# Altium schematic sheet 0273_GPU STRAPS-2.SchDoc
size 848 x 558 mm
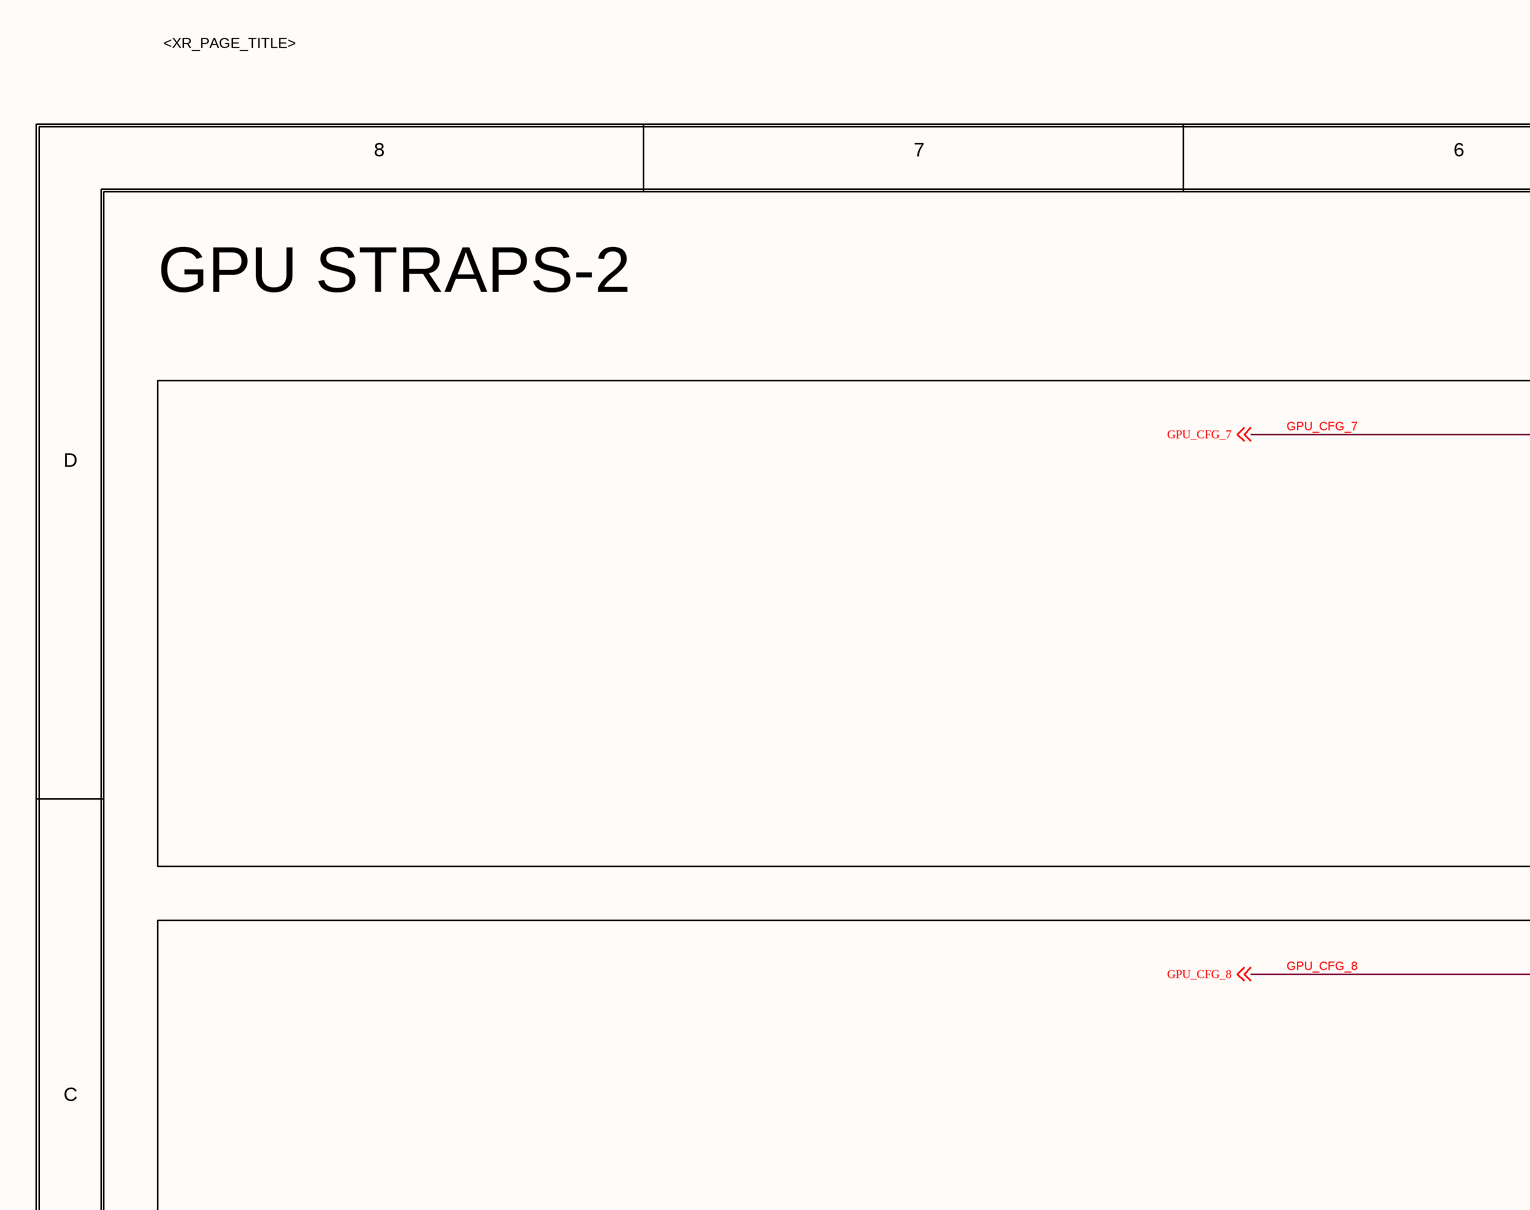
[diagram p0: 0273_GPU STRAPS-2.SchDoc, top left]
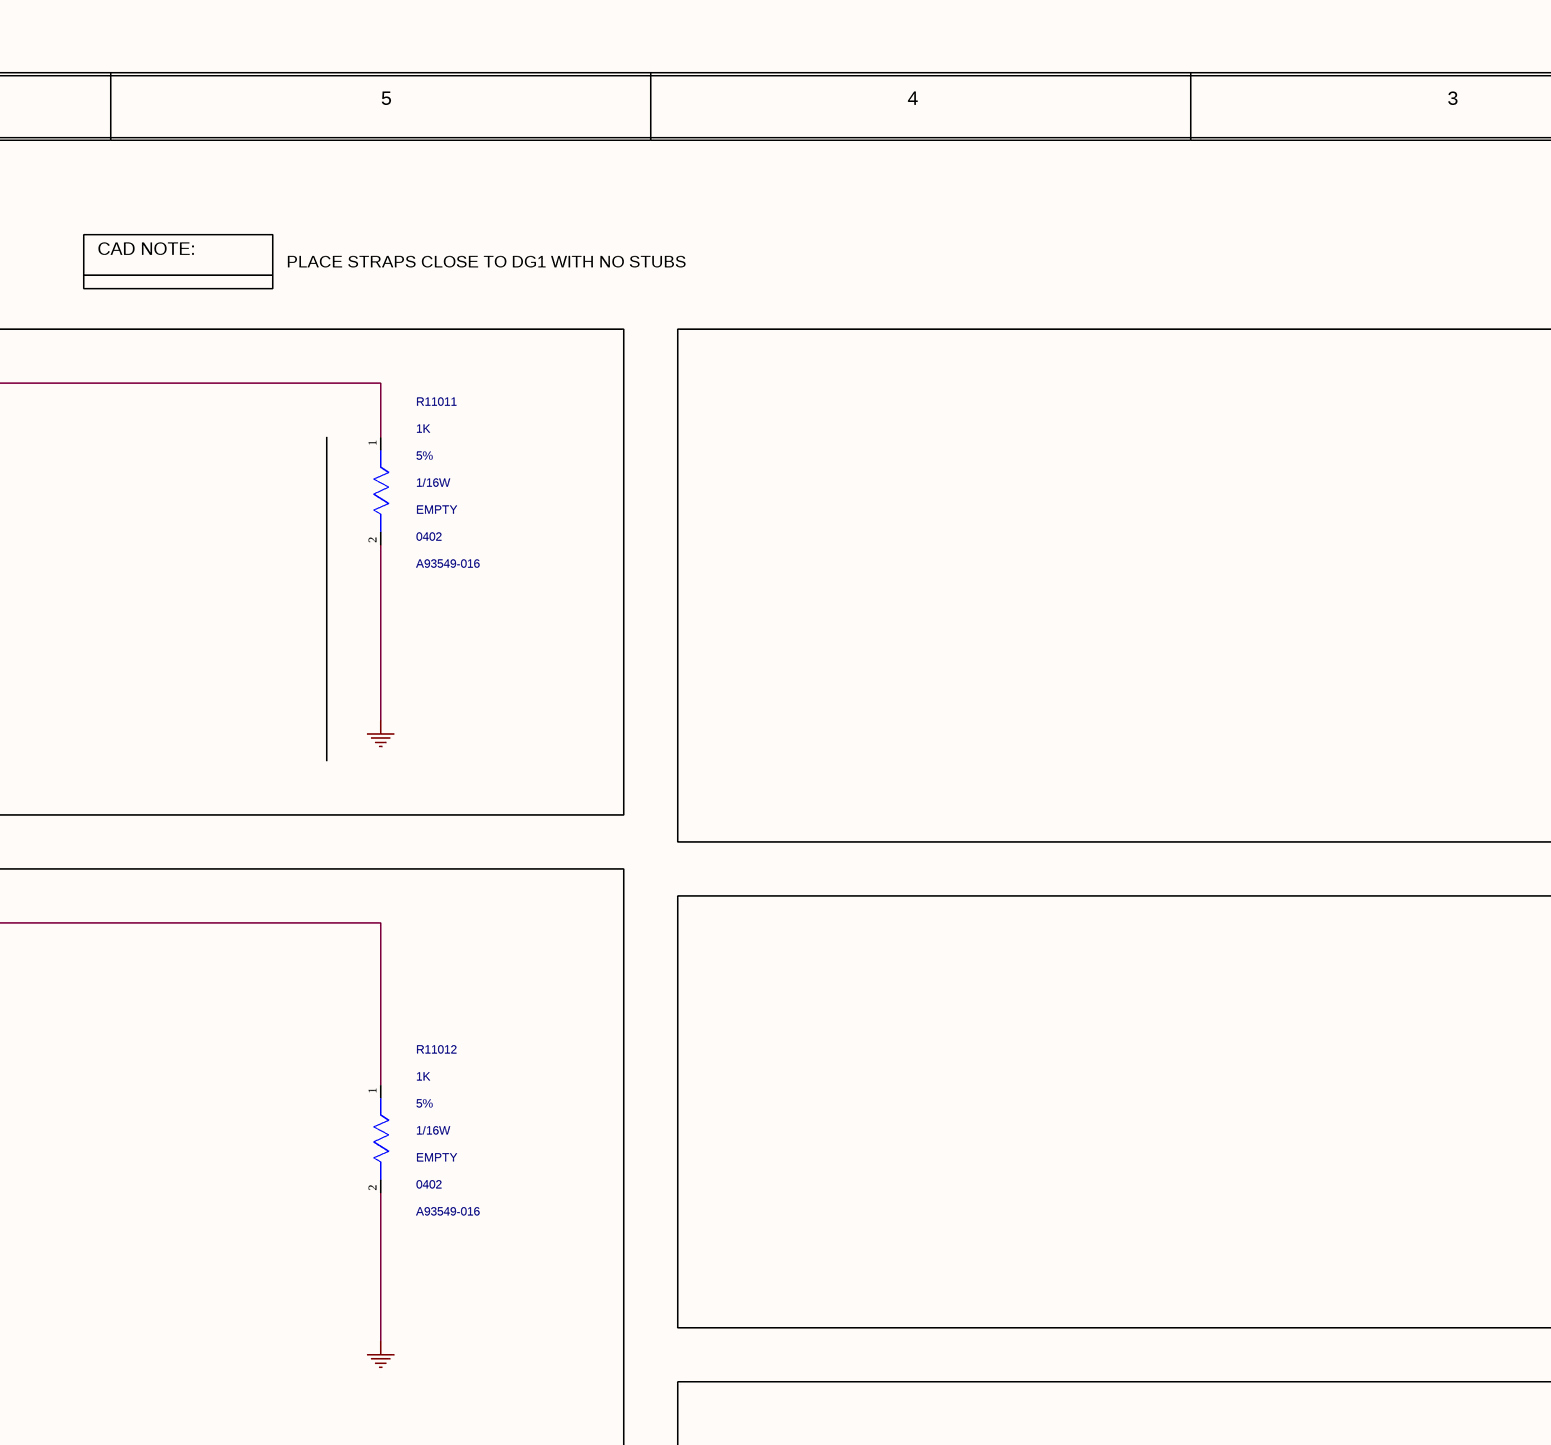
[diagram p1: 0273_GPU STRAPS-2.SchDoc, top middle]
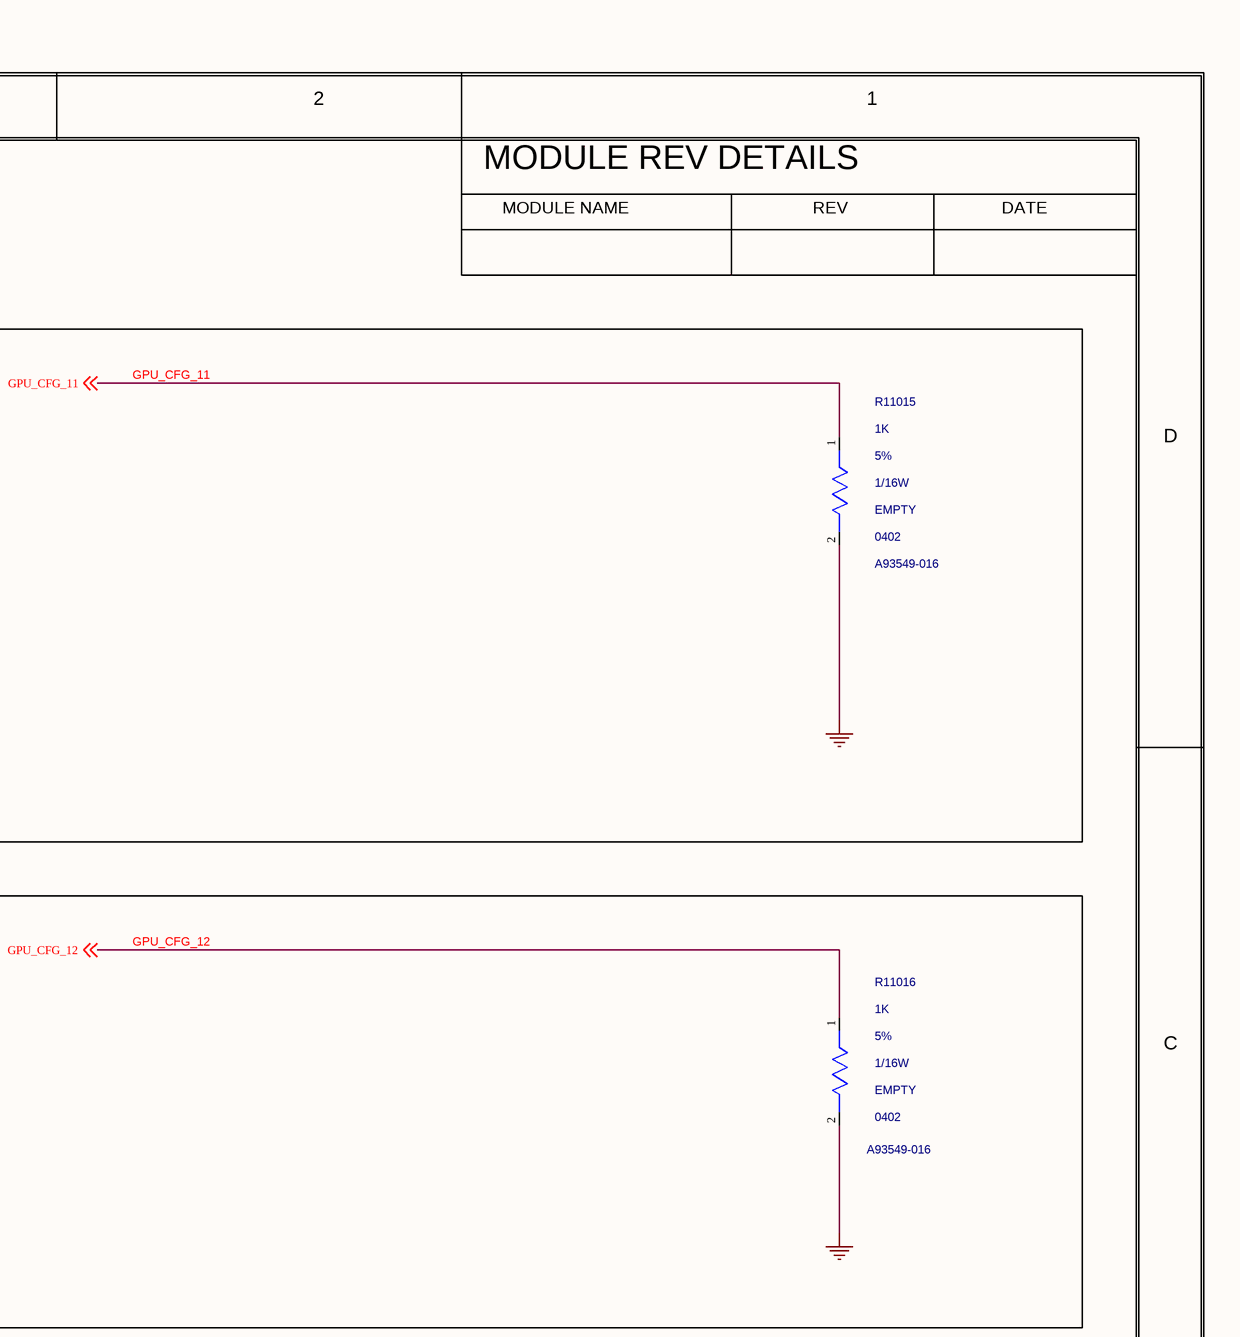
[diagram p2: 0273_GPU STRAPS-2.SchDoc, top right]
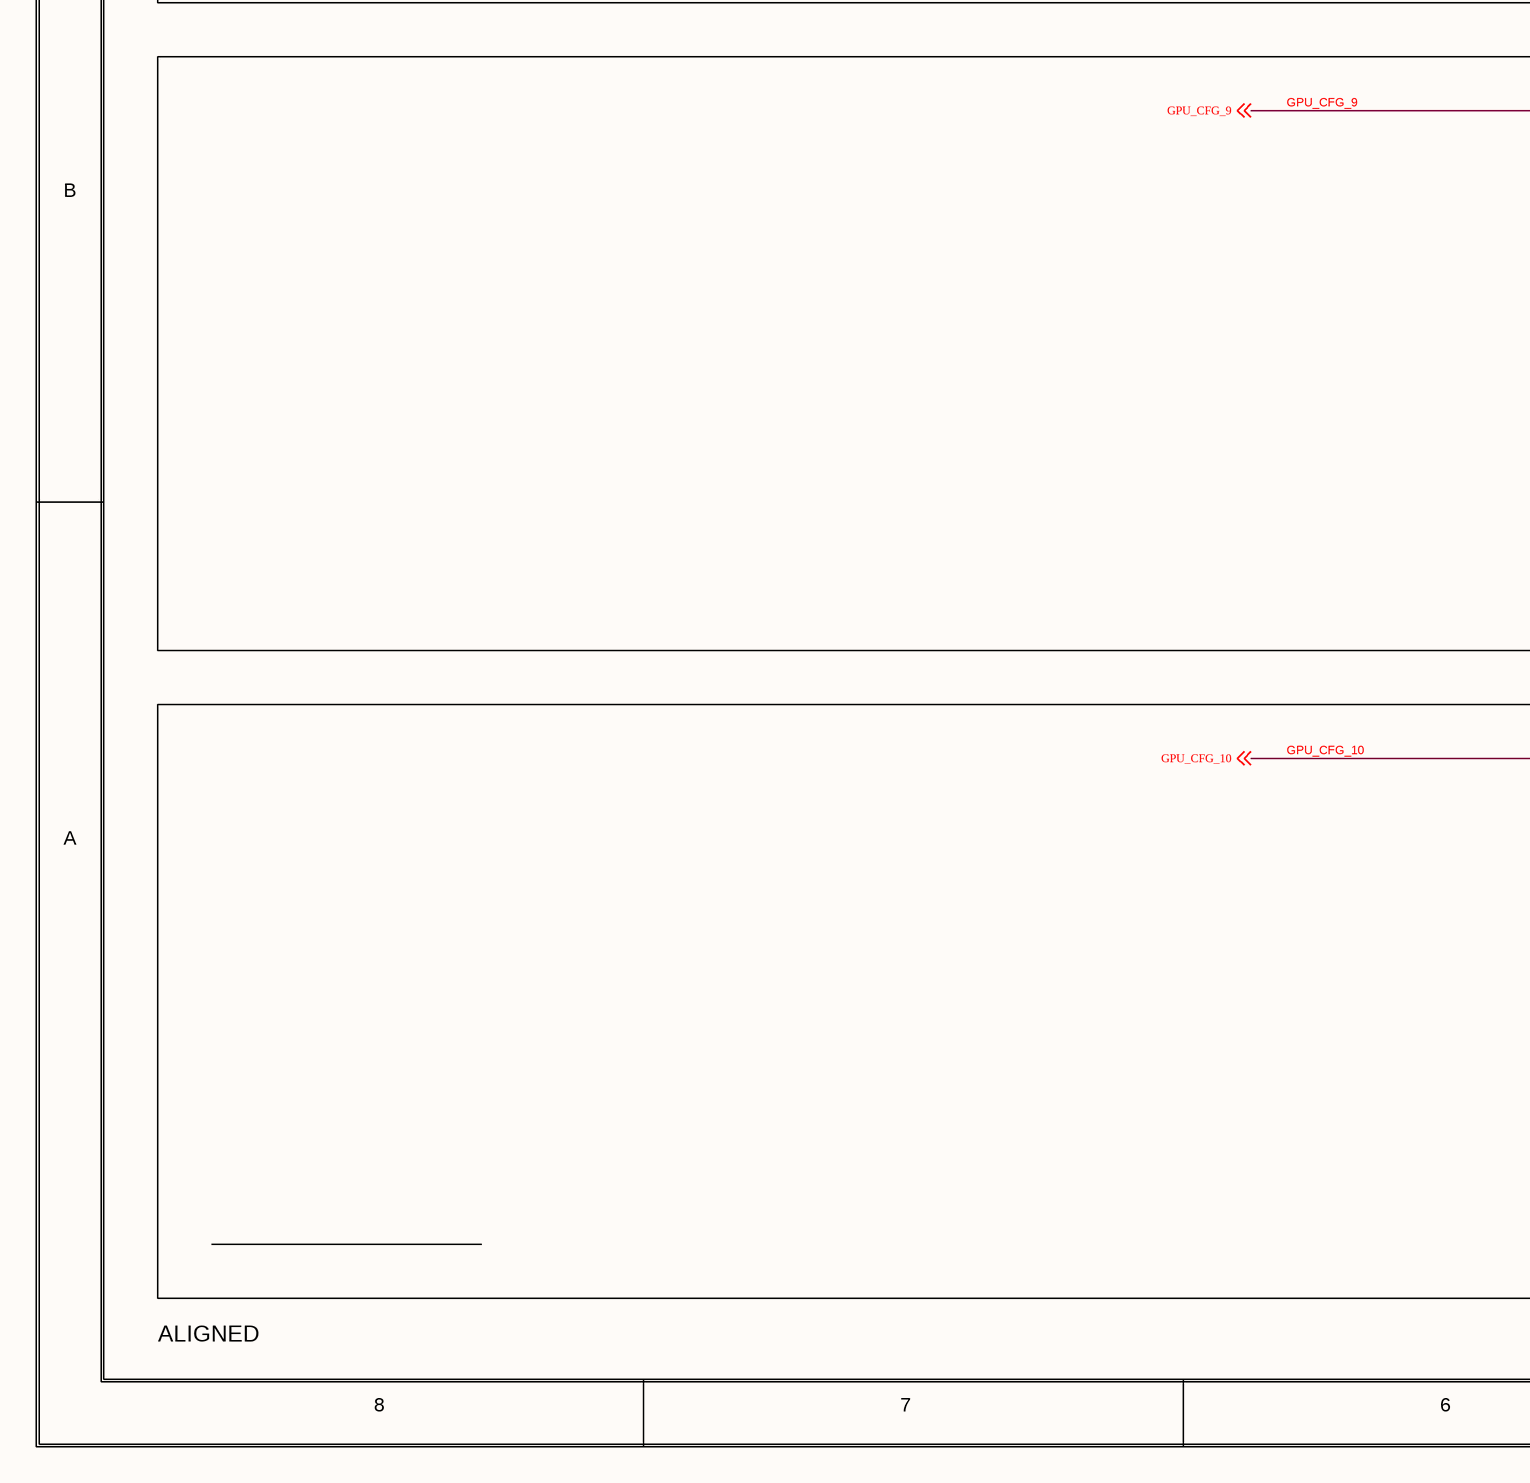
[diagram p3: 0273_GPU STRAPS-2.SchDoc, bottom left]
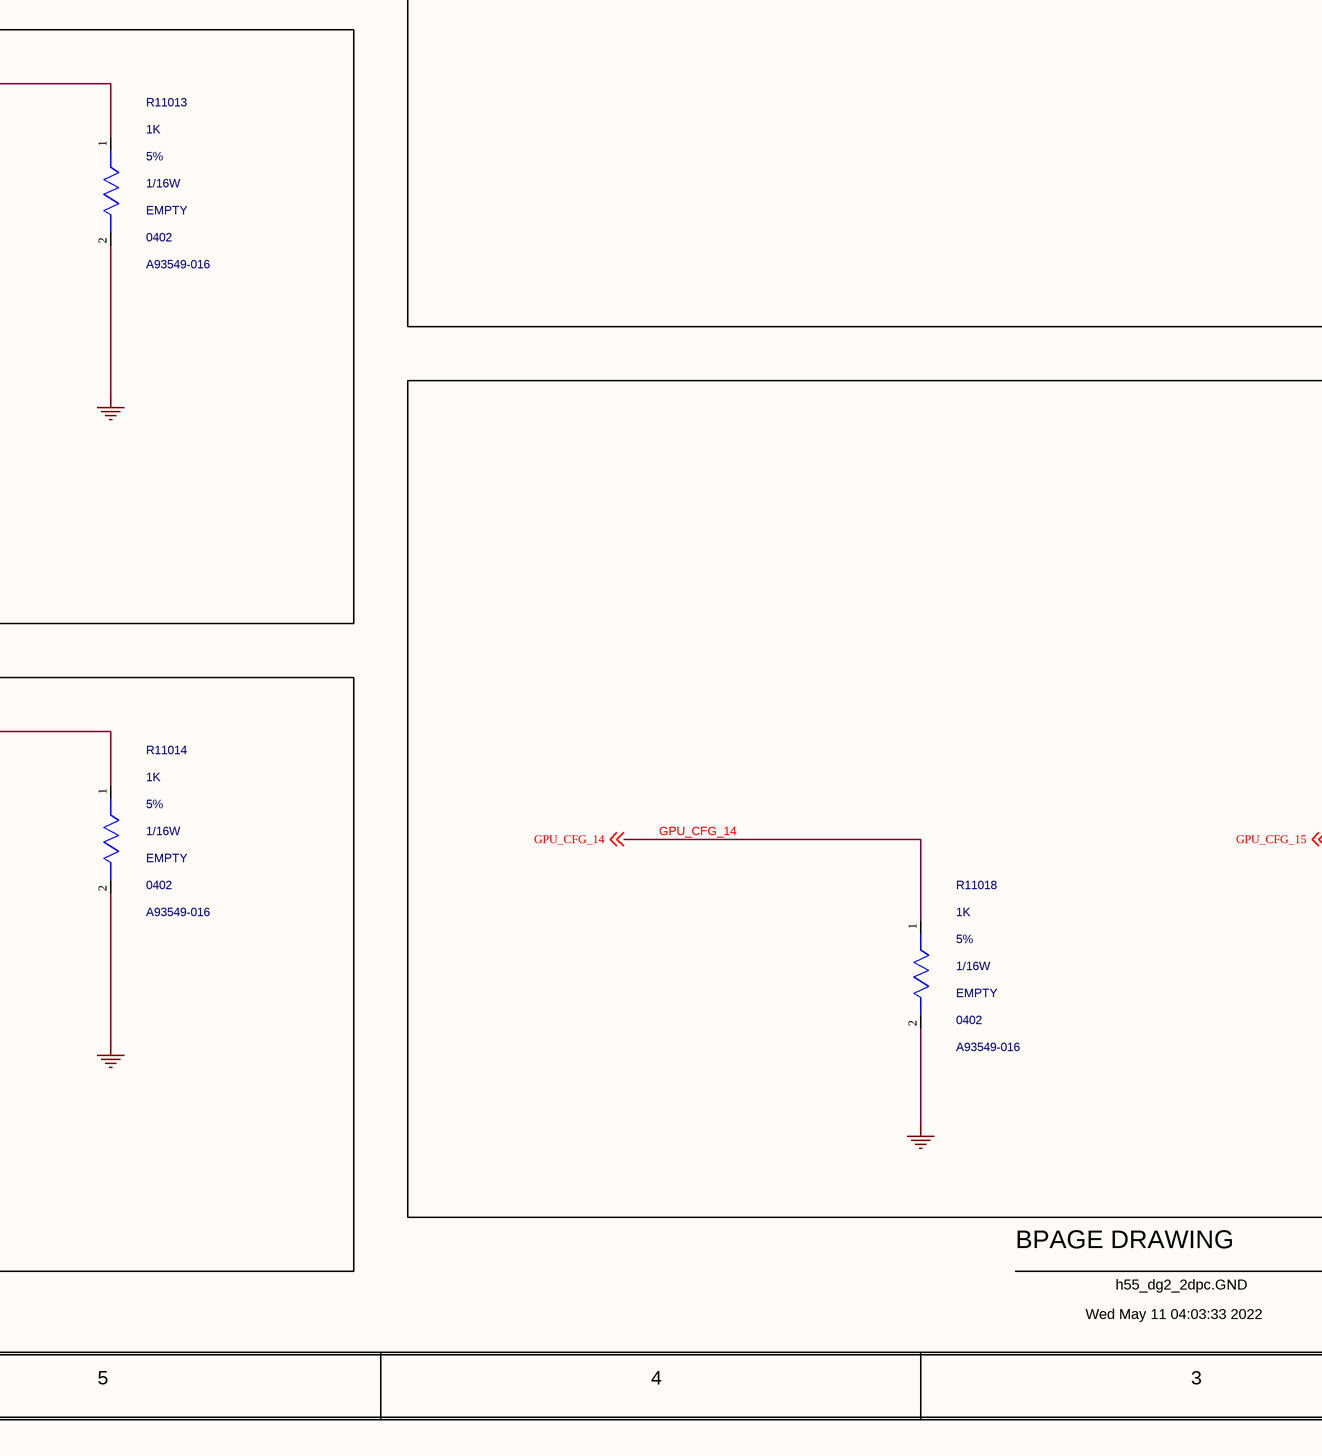
[diagram p4: 0273_GPU STRAPS-2.SchDoc, bottom middle]
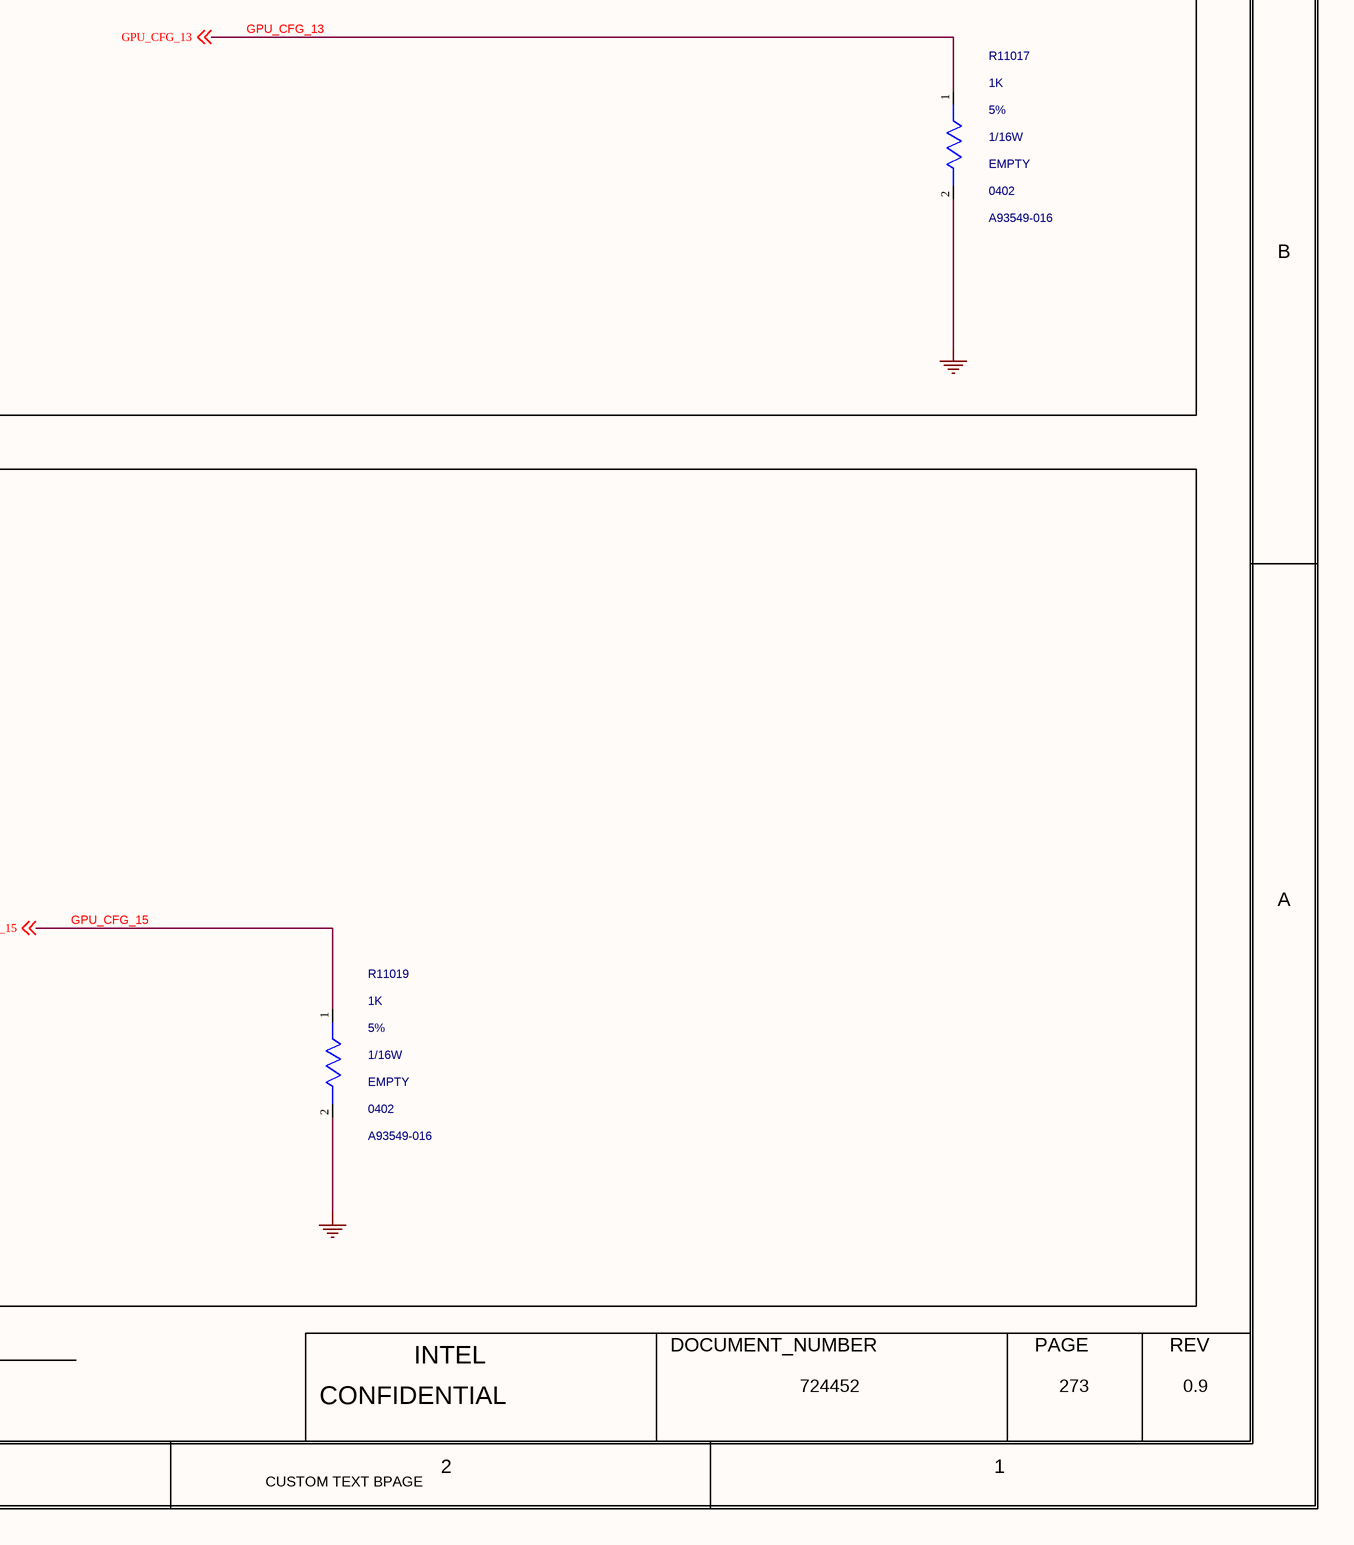
[diagram p5: 0273_GPU STRAPS-2.SchDoc, bottom right]

## Parts
R11011  1K  MATERIAL: EMPTY  PACK_TYPE: 0402  PART_NUMBER: A93549-016  TOLERANCE: 5%  WATTAGE: 1/16W  [SMR0402IA]
R11012  1K  MATERIAL: EMPTY  PACK_TYPE: 0402  PART_NUMBER: A93549-016  TOLERANCE: 5%  WATTAGE: 1/16W  [SMR0402IA]
R11013  1K  MATERIAL: EMPTY  PACK_TYPE: 0402  PART_NUMBER: A93549-016  TOLERANCE: 5%  WATTAGE: 1/16W  [SMR0402IA]
R11014  1K  MATERIAL: EMPTY  PACK_TYPE: 0402  PART_NUMBER: A93549-016  TOLERANCE: 5%  WATTAGE: 1/16W  [SMR0402IA]
R11015  1K  MATERIAL: EMPTY  PACK_TYPE: 0402  PART_NUMBER: A93549-016  TOLERANCE: 5%  WATTAGE: 1/16W  [SMR0402IA]
R11016  1K  MATERIAL: EMPTY  PACK_TYPE: 0402  PART_NUMBER: A93549-016  TOLERANCE: 5%  WATTAGE: 1/16W  [SMR0402IA]
R11017  1K  MATERIAL: EMPTY  PACK_TYPE: 0402  PART_NUMBER: A93549-016  TOLERANCE: 5%  WATTAGE: 1/16W  [SMR0402IA]
R11018  1K  MATERIAL: EMPTY  PACK_TYPE: 0402  PART_NUMBER: A93549-016  TOLERANCE: 5%  WATTAGE: 1/16W  [SMR0402IA]
R11019  1K  MATERIAL: EMPTY  PACK_TYPE: 0402  PART_NUMBER: A93549-016  TOLERANCE: 5%  WATTAGE: 1/16W  [SMR0402IA]

## Nets
GND: R11011.2(B) R11012.2(B) R11013.2(B) R11014.2(B) R11015.2(B) R11016.2(B) R11017.2(B) R11018.2(B) R11019.2(B)
GPU_CFG_7: R11011.1(A) ; off-sheet GPU_CFG_7
GPU_CFG_8: R11012.1(A) ; off-sheet GPU_CFG_8
GPU_CFG_9: R11013.1(A) ; off-sheet GPU_CFG_9
GPU_CFG_10: R11014.1(A) ; off-sheet GPU_CFG_10
GPU_CFG_11: R11015.1(A) ; off-sheet GPU_CFG_11
GPU_CFG_12: R11016.1(A) ; off-sheet GPU_CFG_12
GPU_CFG_13: R11017.1(A) ; off-sheet GPU_CFG_13
GPU_CFG_14: R11018.1(A) ; off-sheet GPU_CFG_14
GPU_CFG_15: R11019.1(A) ; off-sheet GPU_CFG_15

## Notes on the sheet
- <XR_PAGE_TITLE>
- 8
- 7
- 6
- 5
- 4
- 3
- 2
- 1
- MODULE REV DETAILS
- GPU STRAPS-2
- CAD NOTE:
- PLACE STRAPS CLOSE TO DG1 WITH NO STUBS
- MODULE NAME
- REV
- DATE
- D
- C
- B
- A
- BPAGE DRAWING
- INTEL
- DOCUMENT_NUMBER
- PAGE
- ALIGNED
- Wed May 11 04:03:33 2022
- h55_dg2_2dpc.GND
- CONFIDENTIAL
- 724452
- 273
- 0.9
- CUSTOM TEXT BPAGE

## Library data of the parts
R11011 = RES: CDS_PHYS_PART_NAME: RES_0402-A93549-016,EMPTY,1K,5%,1/16W,LPDB,GENERIC; OriginalSymbolOrigin: (-25,75); XY: (-4500,4350); VER: 2; ROT: 0; PHYS_PAGE: 273; LOCATION: R11011; DRAWING: @RVP1_ADL_SB_ADP_S_DDR5_SODIMM_2DPC_LIB.H55_DG2_2DPC(SCH_1):PAGE446; CDS_LIB: discrete; PCB Footprint: SMR0402IA; CHIPS_PART_NAME: RES; CDS_PART_NAME: RES_0402-A93549-016,EMPTY,1K,5%,1/16W,LPDB,GENERIC; CDS_LOCATION: R11011
R11012 = RES: CDS_PHYS_PART_NAME: RES_0402-A93549-016,EMPTY,1K,5%,1/16W,LPDB,GENERIC; OriginalSymbolOrigin: (-25,75); XY: (-4500,3150); VER: 2; ROT: 0; PHYS_PAGE: 273; LOCATION: R11012; DRAWING: @RVP1_ADL_SB_ADP_S_DDR5_SODIMM_2DPC_LIB.H55_DG2_2DPC(SCH_1):PAGE446; CDS_LIB: discrete; PCB Footprint: SMR0402IA; CHIPS_PART_NAME: RES; CDS_PART_NAME: RES_0402-A93549-016,EMPTY,1K,5%,1/16W,LPDB,GENERIC; CDS_LOCATION: R11012
R11013 = RES: CDS_PHYS_PART_NAME: RES_0402-A93549-016,EMPTY,1K,5%,1/16W,LPDB,GENERIC; OriginalSymbolOrigin: (-25,75); XY: (-4500,2150); VER: 2; ROT: 0; PHYS_PAGE: 273; LOCATION: R11013; DRAWING: @RVP1_ADL_SB_ADP_S_DDR5_SODIMM_2DPC_LIB.H55_DG2_2DPC(SCH_1):PAGE446; CDS_LIB: discrete; PCB Footprint: SMR0402IA; CHIPS_PART_NAME: RES; CDS_PART_NAME: RES_0402-A93549-016,EMPTY,1K,5%,1/16W,LPDB,GENERIC; CDS_LOCATION: R11013
R11014 = RES: CDS_PHYS_PART_NAME: RES_0402-A93549-016,EMPTY,1K,5%,1/16W,LPDB,GENERIC; OriginalSymbolOrigin: (-25,75); XY: (-4500,950); VER: 2; ROT: 0; PHYS_PAGE: 273; LOCATION: R11014; DRAWING: @RVP1_ADL_SB_ADP_S_DDR5_SODIMM_2DPC_LIB.H55_DG2_2DPC(SCH_1):PAGE446; CDS_LIB: discrete; PCB Footprint: SMR0402IA; CHIPS_PART_NAME: RES; CDS_PART_NAME: RES_0402-A93549-016,EMPTY,1K,5%,1/16W,LPDB,GENERIC; CDS_LOCATION: R11014
R11015 = RES: CDS_PHYS_PART_NAME: RES_0402-A93549-016,EMPTY,1K,5%,1/16W,LPDB,GENERIC; OriginalSymbolOrigin: (-25,75); XY: (-550,4350); VER: 2; ROT: 0; PHYS_PAGE: 273; LOCATION: R11015; DRAWING: @RVP1_ADL_SB_ADP_S_DDR5_SODIMM_2DPC_LIB.H55_DG2_2DPC(SCH_1):PAGE446; CDS_LIB: discrete; PCB Footprint: SMR0402IA; CHIPS_PART_NAME: RES; CDS_PART_NAME: RES_0402-A93549-016,EMPTY,1K,5%,1/16W,LPDB,GENERIC; CDS_LOCATION: R11015
R11016 = RES: CDS_PHYS_PART_NAME: RES_0402-A93549-016,EMPTY,1K,5%,1/16W,LPDB,GENERIC; OriginalSymbolOrigin: (-25,75); XY: (-550,3275); VER: 2; ROT: 0; PHYS_PAGE: 273; LOCATION: R11016; DRAWING: @RVP1_ADL_SB_ADP_S_DDR5_SODIMM_2DPC_LIB.H55_DG2_2DPC(SCH_1):PAGE446; CDS_LIB: discrete; PCB Footprint: SMR0402IA; CHIPS_PART_NAME: RES; CDS_PART_NAME: RES_0402-A93549-016,EMPTY,1K,5%,1/16W,LPDB,GENERIC; CDS_LOCATION: R11016
R11017 = RES: CDS_PHYS_PART_NAME: RES_0402-A93549-016,EMPTY,1K,5%,1/16W,LPDB,GENERIC; OriginalSymbolOrigin: (-25,75); XY: (-550,2400); VER: 2; ROT: 0; PHYS_PAGE: 273; LOCATION: R11017; DRAWING: @RVP1_ADL_SB_ADP_S_DDR5_SODIMM_2DPC_LIB.H55_DG2_2DPC(SCH_1):PAGE446; CDS_LIB: discrete; PCB Footprint: SMR0402IA; CHIPS_PART_NAME: RES; CDS_PART_NAME: RES_0402-A93549-016,EMPTY,1K,5%,1/16W,LPDB,GENERIC; CDS_LOCATION: R11017
R11018 = RES: CDS_PHYS_PART_NAME: RES_0402-A93549-016,EMPTY,1K,5%,1/16W,LPDB,GENERIC; OriginalSymbolOrigin: (-25,75); XY: (-3000,700); VER: 2; ROT: 0; PHYS_PAGE: 273; LOCATION: R11018; DRAWING: @RVP1_ADL_SB_ADP_S_DDR5_SODIMM_2DPC_LIB.H55_DG2_2DPC(SCH_1):PAGE446; CDS_LIB: discrete; PCB Footprint: SMR0402IA; CHIPS_PART_NAME: RES; CDS_PART_NAME: RES_0402-A93549-016,EMPTY,1K,5%,1/16W,LPDB,GENERIC; CDS_LOCATION: R11018
R11019 = RES: CDS_PHYS_PART_NAME: RES_0402-A93549-016,EMPTY,1K,5%,1/16W,LPDB,GENERIC; OriginalSymbolOrigin: (-25,75); XY: (-1700,700); VER: 2; ROT: 0; PHYS_PAGE: 273; LOCATION: R11019; DRAWING: @RVP1_ADL_SB_ADP_S_DDR5_SODIMM_2DPC_LIB.H55_DG2_2DPC(SCH_1):PAGE446; CDS_LIB: discrete; PCB Footprint: SMR0402IA; CHIPS_PART_NAME: RES; CDS_PART_NAME: RES_0402-A93549-016,EMPTY,1K,5%,1/16W,LPDB,GENERIC; CDS_LOCATION: R11019